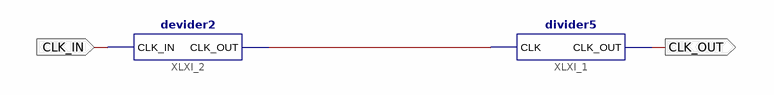
[diagram p0: schematic sheet 1]
// Xilinx ISE schematic divider10.sch (spartan6) as structural Verilog: 2 symbols, 2 ports
module divider10 (
  input  CLK_IN,
  output CLK_OUT
);

  wire XLXN_1;

  divider5 XLXI_1 (.CLK(XLXN_1), .CLK_OUT(CLK_OUT));
  devider2 XLXI_2 (.CLK_IN(CLK_IN), .CLK_OUT(XLXN_1));
endmodule
